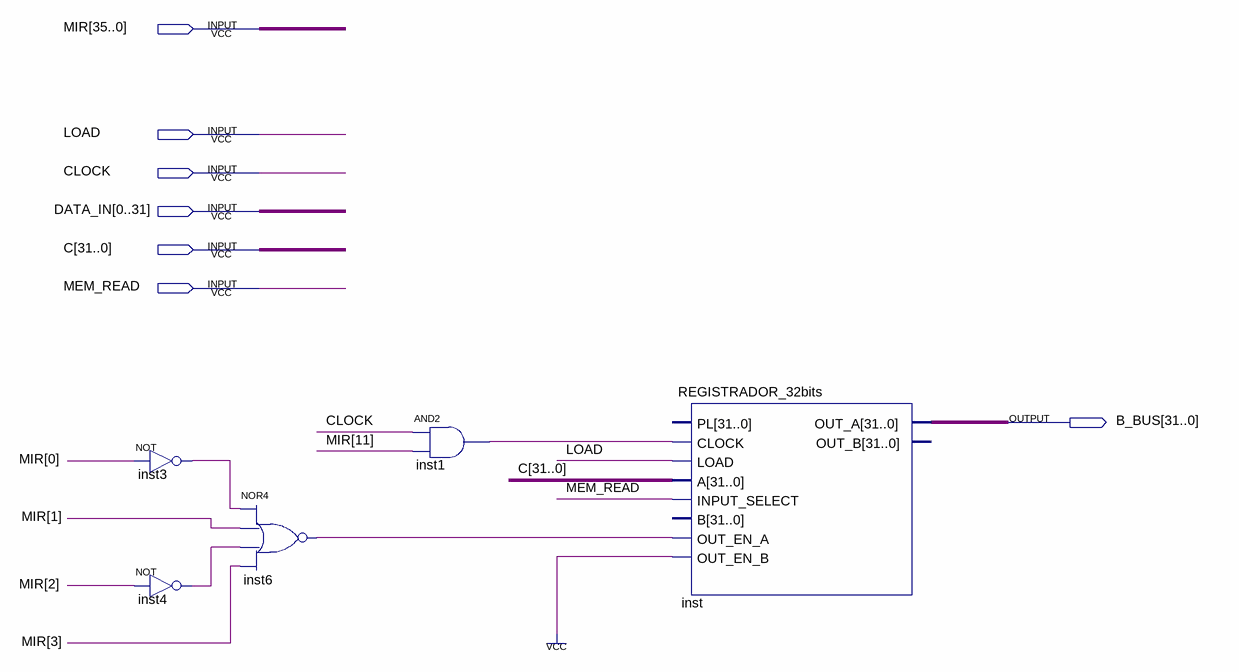
[diagram p0: schematic sheet]
// Quartus schematic LV.bdf as structural Verilog: 5 symbols, 7 pins
module LV (
  input  [35:0] MIR,
  input  LOAD,
  input  CLOCK,
  input  [0:31] DATA_IN,
  input  [31:0] C,
  input  MEM_READ,
  output [31:0] B_BUS
);

  wire inst1_out, inst3_out, inst4_out, inst6_out;

  not inst3 (inst3_out, MIR[0]);
  not inst4 (inst4_out, MIR[2]);
  nor inst6 (inst6_out, inst3_out, MIR[1], inst4_out, MIR[3]);
  and inst1 (inst1_out, CLOCK, MIR[11]);
  REGISTRADOR_32bits inst (
    .CLOCK(inst1_out), .LOAD(LOAD), .A(C), .INPUT_SELECT(MEM_READ), .OUT_EN_A(inst6_out), .OUT_EN_B(1'b1),
    .OUT_A(B_BUS));  // open: PL, B, OUT_B
endmodule
